# Altium schematic sheet main.SchDoc
size A4
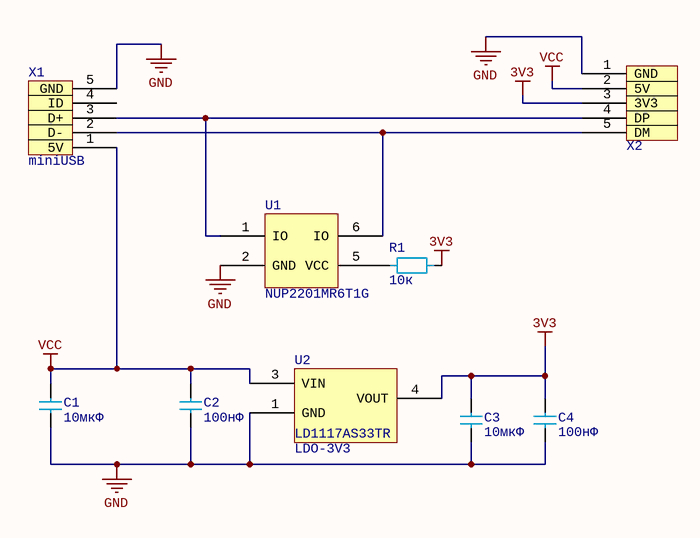
[diagram p0: main.SchDoc]

## Parts
C1  Capacity: 10мкФ  [CAPC2012-0805]  (hidden comment: C-керамика)
C2  Capacity: 100нФ  [CAPC2012-0805]  (hidden comment: C-керамика)
C3  Capacity: 10мкФ  [CAPC2012-0805]  (hidden comment: C-керамика)
C4  Capacity: 100нФ  [CAPC2012-0805]  (hidden comment: C-керамика)
R1  Resistance: 10к  [CR2012-0805]  (hidden comment: R)
U1  NUP2201MR6T1G  [SOT-23-6]
U2  LDO-3V3  [SOT-223]
X1  miniUSB  [USB/SM0.8-6H5]
X2  *  [PBS_5-1]  (value not drawn)

## Nets
3V3: C3.1 C4.1 R1.2 U2.4(VOUT) X2.3(3V3)
GND: C1.2 C2.2 C3.2 C4.2 U1.2(GND) U2.1(GND) X1.5(GND) X2.1(GND)
VCC: C1.1 C2.1 U2.3(VIN) X1.1(5V) X2.2(5V)
NetR1_1: R1.1 U1.5(VCC)
NetU1_1: U1.1(IO) X1.3(D+) X2.4(DP)
NetU1_6: U1.6(IO) X1.2(D-) X2.5(DM)

Not connected (* = marked no-connect by the designer): X1 4(ID)

## Library data of the parts
C1-C4 = C-керамика: Керамический конденсатор
R1 = R: Резистор
U2 = LD1117AS33TR: Voltage regulator, 3v3
X2 = PBS-5-1